# EAGLE design g3d2_master (EAGLE 5.12)
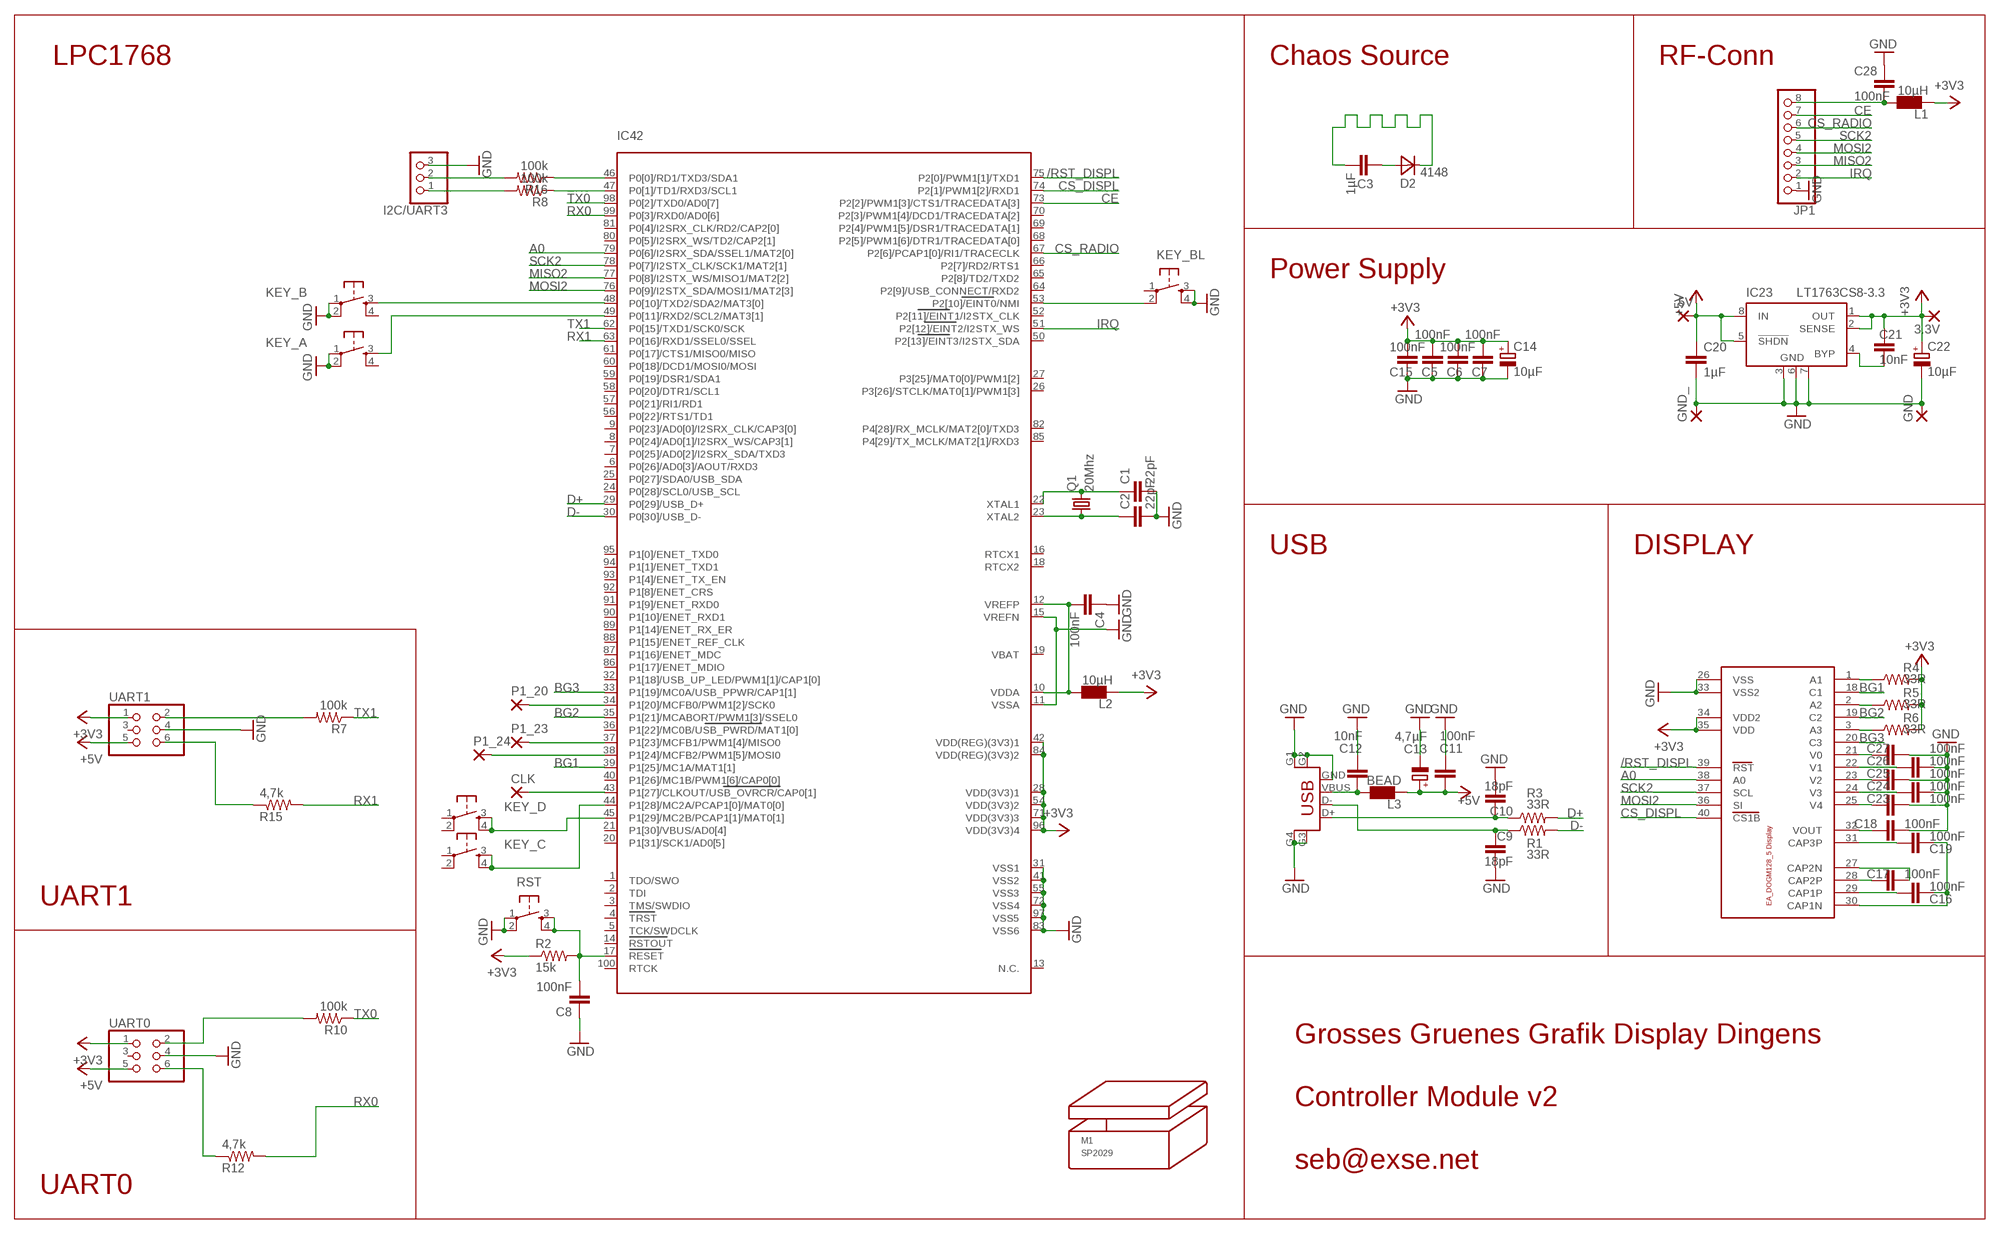
[diagram p0: schematic, sheet 1]

## Parts
3.3V  SMD2  [SMD1,27-2,54]
5V  SMD2  [SMD1,27-2,54]
C1  22pF  CAP0805  [0805]
C2  22pF  CAP0805  [0805]
C3  1µF  CAP0805  [0805]
C4  100nF  CAP0805  [0805]
C5  100nF  CAP0805  [0805]
C6  100nF  CAP0805  [0805]
C7  100nF  CAP0805  [0805]
C8  100nF  CAP0805  [0805]
C9  18pF  CAP0805  [0805]
C10  18pF  CAP0805  [0805]
C11  100nF  CAP0805  [0805]
C12  10nF  CAP0805  [0805]
C13  4,7µF  CPOL-EUSMCA  [SMC_A]
C14  10µF  CPOL-EUSMCA  [SMC_A]
C15  100nF  CAP0805  [0805]
C16  100nF  CAP0805  [0805]
C17  100nF  CAP0805  [0805]
C18  100nF  CAP0805  [0805]
C19  100nF  CAP0805  [0805]
C20  1µF  CAP0805  [0805]
C21  10nF  CAP0805  [0805]
C22  10µF  CPOL-EUSMCA  [SMC_A]
C23  100nF  CAP0805  [0805]
C24  100nF  CAP0805  [0805]
C25  100nF  CAP0805  [0805]
C26  100nF  CAP0805  [0805]
C27  100nF  CAP0805  [0805]
C28  100nF  CAP0805  [0805]
CLK  SMD2  [SMD1,27-2,54]
D2  4148  DIODE_0805  [DIODE_0805]
GND  SMD2  [SMD1,27-2,54]
GND_  SMD2  [SMD1,27-2,54]
I2C/UART3  PINHD-1X03_2.54-SMD-90°  [1X03SMD/90]
IC23  LT1763CS8-3.3  [SOIC8]
IC42  LPC1768  [LQFP100]
JP1  PINHD-1X08_2.54-SMD  [1X08SMD]
KEY_A  LSH  [LSH]
KEY_B  LSH  [LSH]
KEY_BL  LSH  [LSH]
KEY_C  LSH  [LSH]
KEY_D  LSH  [LSH]
L1  10µH  L0805  [0805]
L2  10µH  L0805  [0805]
L3  BEAD  [0805]
M1  SP2029  [SP2029]
P1_20  SMD2  [SMD1,27-2,54]
P1_23  SMD2  [SMD1,27-2,54]
P1_24  SMD2  [SMD1,27-2,54]
Q1  20Mhz  X22-OSCILLATOR  [X22]
R1  33R  RESISTOR0805-RES  [0805]
R2  15k  RESISTOR0805-RES  [0805]
R3  33R  RESISTOR0805-RES  [0805]
R4  33R  RESISTOR0805-RES  [0805]
R5  33R  RESISTOR0805-RES  [0805]
R6  33R  RESISTOR0805-RES  [0805]
R7  100k  RESISTOR0805-RES  [0805]
R8  100k  RESISTOR0805-RES  [0805]
R10  100k  RESISTOR0805-RES  [0805]
R12  4,7k  RESISTOR0805-RES  [0805]
R15  4,7k  RESISTOR0805-RES  [0805]
R16  100k  RESISTOR0805-RES  [0805]
RST  LSH  [LSH]
U$1  EA_DOG-M_DISPLAY  [E_DOG-M_DISPLAY]
UART0  PINHD-2X03_2.54-90°  [2X03/90]
UART1  PINHD-2X03_2.54-90°  [2X03/90]
X1  USB-SMD-NS  [USB-MINIB-NOSTOP]

## Nets
+3V3: 3.3V.1(P) C5.2 C6.2 C7.2 C14.+ C15.2 C21.1 C22.+ IC23.1(OUT) IC23.2(SENSE) IC42.28(VDD(3V3)1) IC42.42(VDD(REG)(3V3)1) IC42.54(VDD(3V3)2) IC42.71(VDD(3V3)3) IC42.84(VDD(REG)(3V3)2) IC42.96(VDD(3V3)4) L1.2 L2.2 R2.1 R4.2 R5.2 R6.2 U$1.34(VDD2) U$1.35(VDD) UART0.1 UART1.1
+5V: 5V.1(P) C11.1 C13.+ C20.1 IC23.5(!SHDN) IC23.8(IN) L3.2 UART0.5 UART1.5
/RST_DISPL: IC42.75(P2[0]/PWM1[1]/TXD1) U$1.39(RST)
A0: IC42.79(P0[6]/I2SRX_SDA/SSEL1/MAT2[0]) U$1.38(A0)
BG1: IC42.39(P1[25]/MC1A/MAT1[1]) U$1.18(C1)
BG2: IC42.35(P1[21]/MCABORT/PWM1[3]/SSEL0) U$1.19(C2)
BG3: IC42.33(P1[19]/MC0A/USB_PPWR/CAP1[1]) U$1.20(C3)
CE: IC42.73(P2[2]/PWM1[3]/CTS1/TRACEDATA[3]) JP1.7
CS_DISPL: IC42.74(P2[1]/PWM1[2]/RXD1) U$1.40(CS1B)
CS_RADIO: IC42.67(P2[6]/PCAP1[0]/RI1/TRACECLK) JP1.6
D+: IC42.29(P0[29]/USB_D+) R3.2
D-: IC42.30(P0[30]/USB_D-) R1.2
GND: C1.2 C2.2 C4.1 C5.1 C6.1 C7.1 C8.1 C9.1 C10.2 C11.2 C12.2 C13.- C14.- C15.1 C18.1 C20.2 C22.- C23.1 C24.1 C25.1 C26.1 C27.1 C28.1 GND.1(P) GND_.1(P) I2C/UART3.3 IC23.3(GND) IC23.6(GND) IC23.7(GND) IC42.11(VSSA) IC42.15(VREFN) IC42.31(VSS1) IC42.41(VSS2) IC42.55(VSS3) IC42.72(VSS4) IC42.83(VSS6) IC42.97(VSS5) JP1.1 KEY_A.1 KEY_A.2 KEY_B.1 KEY_B.2 KEY_BL.3 KEY_BL.4 RST.1 RST.2 U$1.26(VSS) U$1.33(VSS2) UART0.4 UART1.4 X1.G1(GND) X1.G2(GND) X1.G3(GND) X1.G4(GND) X1.GND
IRQ: IC42.51(P2[12]/EINT2/I2STX_WS) JP1.2
MISO2: IC42.77(P0[8]/I2STX_WS/MISO1/MAT2[2]) JP1.3
MOSI2: IC42.76(P0[9]/I2STX_SDA/MOSI1/MAT2[3]) JP1.4 U$1.36(SI)
N$1: C1.1 IC42.22(XTAL1) Q1.3
N$2: C2.1 IC42.23(XTAL2) Q1.1
N$3: C9.2 R1.1 X1.D-
N$4: IC42.53(P2[10]/EINT0/NMI) KEY_BL.2
N$5: C10.1 R3.1 X1.D+
N$6: C4.2 IC42.10(VDDA) IC42.12(VREFP) L2.1
N$7: C3.2 D2.1(C)
N$8: R10.2 UART0.2
N$9: C12.1 L3.1 X1.VBUS
N$10: IC42.47(P0[1]/TD1/RXD3/SCL1) R8.1
N$11: IC42.44(P1[28]/MC2A/PCAP1[0]/MAT0[0]) KEY_C.3 KEY_C.4
N$12: C8.2 IC42.17(RESET) R2.2 RST.3 RST.4
N$13: IC42.48(P0[10]/TXD2/SDA2/MAT3[0]) KEY_B.3
N$14: IC42.49(P0[11]/RXD2/SCL2/MAT3[1]) KEY_A.3
N$15: IC42.34(P1[20]/MCFB0/PWM1[2]/SCK0) P1_20.1(P)
N$16: IC42.37(P1[23]/MCFB1/PWM1[4]/MISO0) P1_23.1(P)
N$17: IC42.38(P1[24]/MCFB2/PWM1[5]/MOSI0) P1_24.1(P)
N$18: IC42.45(P1[29]/MC2B/PCAP1[1]/MAT0[1]) KEY_D.3 KEY_D.4
N$19: I2C/UART3.1 R8.2
N$20: IC42.46(P0[0]/RD1/TXD3/SDA1) R16.1
N$22: C3.1 D2.2(A)
N$23: CLK.1(P) IC42.43(P1[27]/CLKOUT/USB_OVRCR/CAP0[1])
N$24: C28.2 JP1.8 L1.1
N$25: C17.2 U$1.28(CAP2P)
N$26: C17.1 U$1.27(CAP2N)
N$27: C16.2 U$1.29(CAP1P)
N$28: C21.2 IC23.4(BYP)
N$29: C19.2 U$1.31(CAP3P)
N$30: C18.2 U$1.32(VOUT)
N$31: C16.1 C19.1 U$1.30(CAP1N)
N$32: C26.2 U$1.22(V1)
N$33: C27.2 U$1.21(V0)
N$34: C24.2 U$1.24(V3)
N$35: C23.2 U$1.25(V4)
N$36: C25.2 U$1.23(V2)
N$37: R6.1 U$1.3(A3)
N$38: R5.1 U$1.2(A2)
N$39: R4.1 U$1.1(A1)
N$40: I2C/UART3.2 R16.2
N$45: R12.1 UART0.6
N$49: R7.2 UART1.2
N$51: R15.1 UART1.6
RX0: IC42.99(P0[3]/RXD0/AD0[6]) R12.2
RX1: IC42.63(P0[16]/RXD1/SSEL0/SSEL) R15.2
SCK2: IC42.78(P0[7]/I2STX_CLK/SCK1/MAT2[1]) JP1.5 U$1.37(SCL)
TX0: IC42.98(P0[2]/TXD0/AD0[7]) R10.1
TX1: IC42.62(P0[15]/TXD1/SCK0/SCK) R7.1
Unconnected: IC42.1(TDO/SWO) IC42.2(TDI) IC42.3(TMS/SWDIO) IC42.4(TRST) IC42.5(TCK/SWDCLK) IC42.6(P0[26]/AD0[3]/AOUT/RXD3) IC42.7(P0[25]/AD0[2]/I2SRX_SDA/TXD3) IC42.8(P0[24]/AD0[1]/I2SRX_WS/CAP3[1]) IC42.9(P0[23]/AD0[0]/I2SRX_CLK/CAP3[0]) IC42.13(N.C.) IC42.14(RSTOUT) IC42.16(RTCX1) IC42.18(RTCX2) IC42.20(P1[31]/SCK1/AD0[5]) IC42.21(P1[30]/VBUS/AD0[4]) IC42.24(P0[28]/SCL0/USB_SCL) IC42.25(P0[27]/SDA0/USB_SDA) IC42.26(P3[26]/STCLK/MAT0[1]/PWM1[3]) IC42.27(P3[25]/MAT0[0]/PWM1[2]) IC42.32(P1[18]/USB_UP_LED/PWM1[1]/CAP1[0]) IC42.36(P1[22]/MC0B/USB_PWRD/MAT1[0]) IC42.40(P1[26]/MC1B/PWM1[6]/CAP0[0]) IC42.50(P2[13]/EINT3/I2STX_SDA) IC42.52(P2[11]/EINT1/I2STX_CLK) IC42.56(P0[22]/RTS1/TD1) IC42.57(P0[21]/RI1/RD1) IC42.58(P0[20]/DTR1/SCL1) IC42.59(P0[19]/DSR1/SDA1) IC42.60(P0[18]/DCD1/MOSI0/MOSI) IC42.61(P0[17]/CTS1/MISO0/MISO) IC42.64(P2[9]/USB_CONNECT/RXD2) IC42.65(P2[8]/TD2/TXD2) IC42.66(P2[7]/RD2/RTS1) IC42.68(P2[5]/PWM1[6]/DTR1/TRACEDATA[0]) IC42.69(P2[4]/PWM1[5]/DSR1/TRACEDATA[1]) IC42.70(P2[3]/PWM1[4]/DCD1/TRACEDATA[2]) IC42.80(P0[5]/I2SRX_WS/TD2/CAP2[1]) IC42.81(P0[4]/I2SRX_CLK/RD2/CAP2[0]) IC42.82(P4[28]/RX_MCLK/MAT2[0]/TXD3) IC42.85(P4[29]/TX_MCLK/MAT2[1]/RXD3) IC42.86(P1[17]/ENET_MDIO) IC42.87(P1[16]/ENET_MDC) IC42.88(P1[15]/ENET_REF_CLK) IC42.89(P1[14]/ENET_RX_ER) IC42.90(P1[10]/ENET_RXD1) IC42.91(P1[9]/ENET_RXD0) IC42.92(P1[8]/ENET_CRS) IC42.93(P1[4]/ENET_TX_EN) IC42.94(P1[1]/ENET_TXD1) IC42.95(P1[0]/ENET_TXD0) IC42.100(RTCK) KEY_A.4 KEY_B.4 KEY_BL.1 KEY_C.1 KEY_C.2 KEY_D.1 KEY_D.2 UART0.3 UART1.3

## Notes on the sheet
- LPC1768 | Chaos Source | RF-Conn
- Power Supply
- USB | DISPLAY
- UART1
- Grosses Gruenes Grafik Display Dingens
- Controller Module v2
- seb@exse.net
- UART0

## Power pins joined to a net without a drawn wire
VBAT: IC42.19(VBAT)

## Library data of the parts
3.3V 5V CLK GND GND_ P1_20 P1_23 P1_24 = wirepad:SMD2: SMD PAD
C1-C12 C15-C21 C23-C28 = SparkFun:CAP: Capacitor Standard 0603 ceramic capacitor, and 0.1" leaded capacitor.
C13 C14 C22 = rcl:CPOL-EU: POLARIZED CAPACITOR, European symbol
D2 = seb:DIODE_0805
I2C/UART3 = pinhead-2:PINHD-1X03: PIN HEADER
IC23 = linear-technology:LT1763CS8: 500mA, Low Noise, LDO Micropower Regulators Source: http://cds.linear.com/docs/Datasheet/1763ff.pdf
IC42 = microbuilder:LPC1768: LPC1768 100 MHz 32-bit ARM Cortex-M3 based microcontroller featuring a high level of integration and low power consumption. 512 kB Flash, 64 kB SRAM, USB Device/Host/OTG, Ethernet, CAN, I2S, 10-bit DAC Digikey: 568-4796-ND
JP1 = pinhead-2:PINHD-1X08: PIN HEADER
KEY_A KEY_B KEY_BL KEY_C KEY_D RST = switch-tact:LSH
L1 L2 = seb:L0805
L3 = seb:BEAD
M1 = strapubox:SP2029: Gehäuse Strapubox Typ 2029 max. Bauteilhöhe, top-layer: 11,5 mm max. Bauteilhöhe, bottom-layer: 3,5 mm (Dicke der LP: 1,5 mm) Außenmaße: Länge: 80 mm Breite: 61 mm Höhe: 20,5 mm
Q1 = seb:X22-OSCILLATOR
R1-R8 R10 R12 R15 R16 = SparkFun:RESISTOR: Resistor Basic schematic elements and footprints for 0603, 1206, and PTH resistors.
U$1 = display_ea_dogm128:EA_DOG-M_DISPLAY
UART0 UART1 = pinhead-2:PINHD-2X03: PIN HEADER
X1 = SparkFun:USB: USB Connectors USB-B-PTH is fully proven SKU : PRT-00139 USB-miniB is fully proven SKU : PRT-00587 USB-A-PCB is untested. USB-A-H is throughly reviewed, but untested. Spark Fun Electronics SKU : PRT-00437 USB-B-SMT is throughly reviewed, but untested. Needs silkscreen touching up. USB-A-S has not been used/tested USB-MB-H has not been used/tested

## Net classes
1 FAT: width 0.2 mm, drill 0.4 mm
2 GND/3V3: width 0.2 mm, drill 0.4 mm

## Board
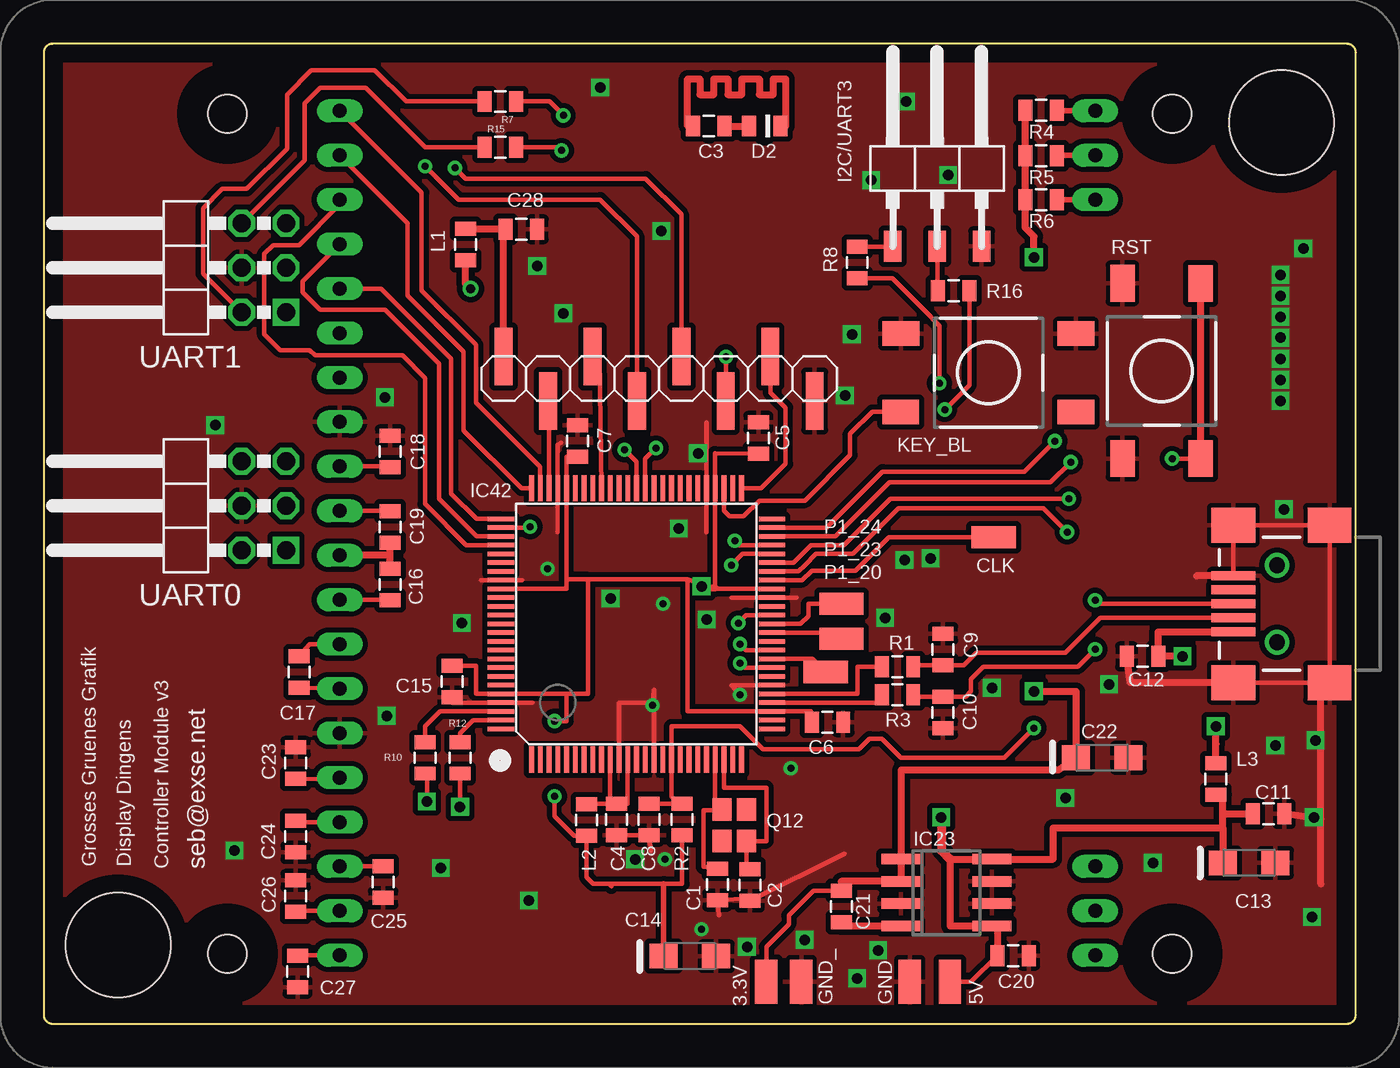
[diagram p1: board, top side]
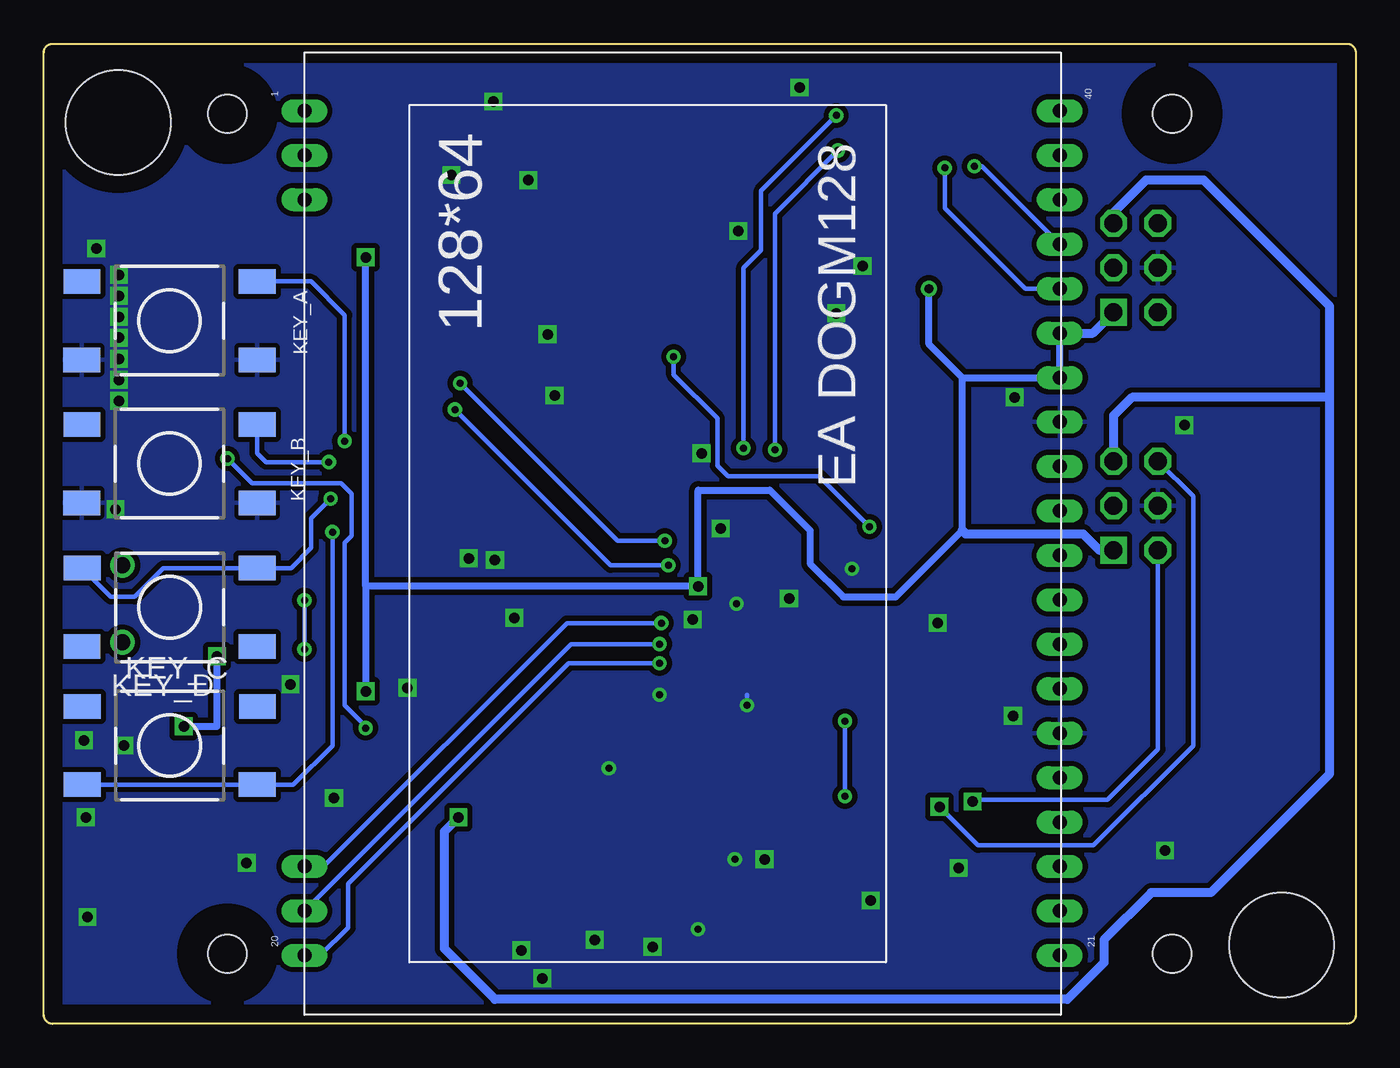
[diagram p2: board, bottom side, seen from below]

Size 75 x 56 mm. Coordinates in mm from the lower left corner, seen from the top.
Copper layers (1*16): Top 0.035mm / dielectric 1.5mm / Bottom 0.035mm
Design rules "default *": minimum track width 10mil, minimum drill 0.4mm, track to track 8mil, track to pad 8mil, pad to pad 8mil, via to via 8mil, smd to smd 8mil, copper to edge 40mil, drill to drill 8mil, minimum pad ring 10mil, minimum via ring 8mil, stop-mask expansion 4mil, vias tented up to drill 40mil, thermal gap 10mil
tRestrict: 2 lines

### Footprints (pad centres in the part's own frame; a part is rotated, then mirrored left to right if it is on the bottom)
SMD1,27-2,54 = smd 1.27 x 2.54: 1 0,0
0805 = smd 0.8 x 1.2: 1 -0.9,0; 2 0.9,0
SMC_A = smd 1.6 x 1.4: + -1.5,0; - 1.5,0
DIODE_0805 = smd 0.8 x 1.2: 1 -0.9,0; 2 0.9,0
1X03SMD/90 = smd 1.016 x 1.778: 1 -1.27,-5.08; 2 1.27,-5.08; 3 3.81,-5.08
SOIC8 = smd 0.6 x 2.2: 1 -1.905,-2.6; 2 -0.635,-2.6; 3 0.635,-2.6; 4 1.905,-2.6; 5 1.905,2.6; 6 0.635,2.6; 7 -0.635,2.6; 8 -1.905,2.6
LQFP100 = smd 0.27 x 1.5: 1 -6,-7.75; 2 -5.5,-7.75; 3 -5,-7.75; 4 -4.5,-7.75; 5 -4,-7.75; 6 -3.5,-7.75; 7 -3,-7.75; 8 -2.5,-7.75; 9 -2,-7.75; 10 -1.5,-7.75; 11 -1,-7.75; 12 -0.5,-7.75; 13 0,-7.75; 14 0.5,-7.75; 15 1,-7.75; 16 1.5,-7.75; 17 2,-7.75; 18 2.5,-7.75; 19 3,-7.75; 20 3.5,-7.75; 21 4,-7.75; 22 4.5,-7.75; 23 5,-7.75; 24 5.5,-7.75; 25 6,-7.75; 51 6,7.75; 52 5.5,7.75; 53 5,7.75; 54 4.5,7.75; 55 4,7.75; 56 3.5,7.75; 57 3,7.75; 58 2.5,7.75; 59 2,7.75; 60 1.5,7.75; 61 1,7.75; 62 0.5,7.75; 63 0,7.75; 64 -0.5,7.75; 65 -1,7.75; 66 -1.5,7.75; 67 -2,7.75; 68 -2.5,7.75; 69 -3,7.75; 70 -3.5,7.75; 71 -4,7.75; 72 -4.5,7.75; 73 -5,7.75; 74 -5.5,7.75; 75 -6,7.75 | smd 1.5 x 0.27: 26 7.75,-6; 27 7.75,-5.5; 28 7.75,-5; 29 7.75,-4.5; 30 7.75,-4; 31 7.75,-3.5; 32 7.75,-3; 33 7.75,-2.5; 34 7.75,-2; 35 7.75,-1.5; 36 7.75,-1; 37 7.75,-0.5; 38 7.75,0; 39 7.75,0.5; 40 7.75,1; 41 7.75,1.5; 42 7.75,2; 43 7.75,2.5; 44 7.75,3; 45 7.75,3.5; 46 7.75,4; 47 7.75,4.5; 48 7.75,5; 49 7.75,5.5; 50 7.75,6; 76 -7.75,6; 77 -7.75,5.5; 78 -7.75,5; 79 -7.75,4.5; 80 -7.75,4; 81 -7.75,3.5; 82 -7.75,3; 83 -7.75,2.5; 84 -7.75,2; 85 -7.75,1.5; 86 -7.75,1; 87 -7.75,0.5; 88 -7.75,0; 89 -7.75,-0.5; 90 -7.75,-1; 91 -7.75,-1.5; 92 -7.75,-2; 93 -7.75,-2.5; 94 -7.75,-3; 95 -7.75,-3.5; 96 -7.75,-4; 97 -7.75,-4.5; 98 -7.75,-5; 99 -7.75,-5.5; 100 -7.75,-6
1X08SMD = smd 1.016 x 3.302: 1 -1.27,1.27; 2 1.27,-1.27; 3 3.81,1.27; 4 6.35,-1.27; 5 8.89,1.27; 6 11.43,-1.27; 7 13.97,1.27; 8 16.51,-1.27
LSH = smd 2.1 x 1.4: 1 -5.005,2.24; 2 5.015,2.24; 3 -5.005,-2.24; 4 5.005,-2.24
SP2029 = hole 2.2: -27,-24; -27,24; 27,24; 27,-24 | hole 6: 33.25,23.5; -33.25,-23.5
X22 = smd 1.3 x 1.1: 1 0.9,0.7; 2 -0.9,0.7; 3 -0.9,-0.7; 4 0.9,-0.7
E_DOG-M_DISPLAY = drill 0.8 long: 1 0.032,0; 2 2.572,0; 3 5.112,0; 18 43.212,0; 19 45.752,0; 20 48.292,0; 21 48.292,43.18; 22 45.752,43.18; 23 43.212,43.18; 24 40.672,43.18; 25 38.132,43.18; 26 35.592,43.18; 27 33.052,43.18; 28 30.512,43.18; 29 27.972,43.18; 30 25.432,43.18; 31 22.892,43.18; 32 20.352,43.18; 33 17.812,43.18; 34 15.272,43.18; 35 12.732,43.18; 36 10.192,43.18; 37 7.652,43.18; 38 5.112,43.18; 39 2.572,43.18; 40 0.032,43.18
2X03/90 = drill 1.016 square: 1 -2.54,-6.35 | drill 1.016 octagon: 2 -2.54,-3.81; 3 0,-6.35; 4 0,-3.81; 5 2.54,-6.35; 6 2.54,-3.81
USB-MINIB-NOSTOP = smd 2.5 x 0.5: D+ 2.5,0; D- 2.5,0.8; GND 2.5,-1.6; ID 2.5,-0.8; VBUS 2.5,1.6 | smd 2.5 x 2: G1 -3,-4.5; G2 -3,4.5; G3 2.5,4.5; G4 2.5,-4.5 | drill 0.9 pad 0.8 round: H1 0,2.2 | drill 0.9 pad 0.787 round: H2 0,-2.2

### Placement (x,y rotation side)
3.3V  41.3,2.4 0 top
5V  51.8,2.4 0 top
C1  38.51,7.96 270 top
C2  40.36,7.92 270 top
C3  38,51.3 180 top
C4  32.75,11.68 90 top
C5  40.85,33.46 270 top
C6  44.8,17.24 180 top
C7  30.51,33.3 270 top
C8  34.6,11.68 90 top
C9  51.4,21.4 270 top
C10  51.4,17.8 270 top
C11  70,12 0 top
C12  62.8,21 180 top
C13  68.9,9.2 0 top
C14  36.94,3.87 0 top
C15  23.35,19.57 90 top
C16  19.8,25.1 270 top
C17  14.6,20.1 90 top
C18  19.8,32.7 270 top
C19  19.8,28.4 90 top
C20  55.4,3.9 0 top
C21  45.6,6.7 270 top
C22  60.5,15.2 0 top
C23  14.4,14.9 270 top
C24  14.4,10.7 90 top
C25  19.4,8.1 90 top
C26  14.4,7.3 270 top
C27  14.5,3 90 top
C28  27.31,45.4 180 top
CLK  54.3,27.8 90 top
D2  41.2,51.3 180 top
GND  49.5,2.4 0 top
GND_  43.3,2.4 0 top
I2C/UART3  49.8,49.5 0 top
IC23  51.6,7.5 270 top
IC42  33.88,22.85 0 top
JP1  42.8,36.86 180 top
KEY_A  67.81,40.18 180 bottom
KEY_B  67.81,32.01 180 bottom
KEY_BL  54,37.2 180 top
KEY_C  67.8,15.9 0 bottom
KEY_D  67.8,23.8 180 bottom
L1  24.1,44.52 270 top
L2  31.03,11.65 270 top
L3  67,14 270 top
M1  37.5,28 0 top
P1_20  44.7,20.1 270 top
P1_23  45.6,22 270 top
P1_24  45.6,24 270 top
Q1  39.47,11.34 270 top
R1  48.8,20.4 180 top
R2  36.49,11.68 90 top
R3  48.8,18.8 180 top
R4  57,52.2 180 top
R5  57,49.6 180 top
R6  57,47.1 180 top
R7  26.1,52.7 180 top
R8  46.5,43.5 90 top
R10  21.8,15.2 270 top
R12  23.8,15.2 90 top
R15  26.1,50.1 0 top
R16  52,41.9 180 top
RST  63.9,37.3 90 top
U$1  60.1,52.2 270 bottom
UART0  7.5,29.6 90 top
UART1  7.5,43.2 90 top
X1  70.5,24 180 top

### Tracks (layer width: path | path; a pad name or v marks a point on that pad's centre or on a via)
+3V3  (via drill 0.4, 0.5, 0.6)
  Top 0.254: 29.88,25.4 29.88,24.85 IC42.84 | 29.88,25.4 IC42.71 29.88,32.41 C7.2 | 29.88,18.85 IC42.96 24.7,18.85 24.7,20.47 C15.2 | 29.88,18.85 29.88,17.3 v29.2,17.3 | 38.38,24.9 IC42.54 38.37,32.59 C5.2 | 31.1,25.4 36.8,25.4 | 36.8,25.4 38.38,24.9 | 31.1,25.4 29.88,25.4 | IC42.42 38.38,24.85 38.38,24.9 | C6.2 43.86,17.85 IC42.28 36.8,17.85 36.8,25.4 | R2.1 36.49,8 35.43,8 32.3,8 | 32.3,8 31.4,8 31.03,8.37 L2.2 30.3,10.75 29.2,11.85 v29.2,13 | 29.88,18.85 31.1,18.85 31.1,25.4 | 3.3V.1 41.3,4.4 42.6,5.7 42.6,6.2 44,7.6 C21.1 | 32.3,8 32.45,7.85
  Top 0.305: C14.+ 35.43,6.13 35.43,8
  Top 0.406: v37.6,25 37.6,24.9 38.38,24.9 | R4.2 R5.2 R6.2 56.1,45.5 56.6,45 v56.6,43.8 | C21.1 45.6,8.14 IC23.2 IC23.1 49,14.5 58,14.5 C22.+ 59,19 v56.6,19 | L1.2 24.1,42.3 v24.4,42
  Bottom 0.254: v29.2,13 v29.2,17.3
  Bottom 0.406: 56.6,25 v56.6,19 | 56.6,25 v37.6,25 37.6,30.5 33.5,30.5 31.2,28.2 31.2,26.3 29.3,24.4 26.3,24.4 22.5,28.2 22.5,36.93 | 22.5,36.93 U$1.34 U$1.35 | 56.6,25 v56.6,43.8 | v24.4,42 24.4,38.83 22.5,36.93
  Bottom 0.5: U$1.35 15.04,39.47 UART1.1 | UART0.1 14.66,27.06 15.6,28 22.3,28 22.5,28.2
+5V  (via drill 0.6)
  Top 0.254: 5V.1 53,2.4 C20.1
  Top 0.406: L3.2 67.4,13.1 67.4,12 | 67.4,11.2 C13.+ | 67.4,11.2 67.4,12 | 67.4,12 C11.1 | 67.4,11.2 57.7,11.2 57.7,9.41 IC23.8 51.8,9.41 51.8,5.59 IC23.5 54.5,5.59 C20.1
  Top 0.5: v51.3,11.8 51.3,9.91 51.8,9.41
  Bottom 0.5: UART1.5 13.85,46.35 12,48.2 8.7,48.2 1.5,41 1.5,35.9 | 1.5,35.9 1.5,14.3 8.3,7.5 11.7,7.5 14.4,4.8 14.4,3.5 16.5,1.4 49.2,1.4 52.1,4.3 52.1,11 v51.3,11.8 | UART0.5 13.85,34.75 12.8,35.8 1.6,35.8 1.5,35.9
/RST_DISPL
  Top 0.254: IC42.75 27.3,30.6 24,33.9 24,38.4 20.8,41.6 20.8,45.75 U$1.39
A0
  Top 0.254: IC42.79 24.15,27.35 21.8,29.7 21.8,36.9 20.5,38.2 15.5,38.2 15.2,38.5 13.5,38.5 12.6,39.4 12.6,44 13.1,44.5 14.6,44.5 16.92,46.82 U$1.38
BG1  (via drill 0.4)
  Top 0.254: IC42.39 40.15,23.35 v39.7,22.9
  Bottom 0.254: U$1.18 59,8.99 45.09,22.9 v39.7,22.9
BG2  (via drill 0.4)
  Top 0.254: IC42.35 40.15,21.35 v39.8,21.7
  Bottom 0.254: v39.8,21.7 44.85,21.7 U$1.19
BG3  (via drill 0.4)
  Top 0.254: IC42.33 40.05,20.35 v39.8,20.6
  Bottom 0.254: U$1.20 59.19,3.91 57.6,5.5 57.6,8.01 45.01,20.6 v39.8,20.6
CE
  Top 0.254: JP1.7 28.88,35.34 IC42.73
CS_DISPL
  Top 0.254: IC42.74 28.38,31.82 24.7,35.5 24.7,38.8 21.6,41.9 21.6,47.49 U$1.40
CS_RADIO
  Top 0.254: IC42.67 31.78,38.12 JP1.6
D+
  Top 0.254: IC42.29 47.9,18.35 R3.2
D-
  Top 0.254: IC42.30 46.5,18.85 46.5,20.4 R1.2
GND  (via drill 0.4, 0.6)
  Top 0.254: 39.3,24.35 IC42.41 43.03,24.35 | IC42.31 39.3,19.35 v39.8,18.8 | 29.38,28.1 IC42.72 29.38,33.08 29.56,33.2 | IC42.11 32.88,18.35 34.88,18.35 | 34.88,18.35 IC42.15 | 34.88,18.35 34.88,19.1 v34.8,18.2 | 37.88,34.38 IC42.55 37.88,28.1 | C8.1 34.7,10.78 | C4.1 C8.1 | C8.1 34.7,9.9 | 38.61,6.2 C1.2 40.36,7.16 C2.2 45.78,9.72 | X1.GND X1.G4 X1.G1 X1.G2 73,19.5 X1.G3 71.9,19.5 | C15.1 23.35,18.35 IC42.97 27.93,18.35 | 27.33,25.35 IC42.83 25,25.35
  Top 0.406: 69.1,19.5 X1.G3 62.1,19.5 C12.2 | 73,11.7 73,19.5 | 73,8 73,11.7 | 73,11.7 C11.2 | X1.GND 65.9,25.6
  Bottom 0.254: v34.8,18.2 34.8,18.8
  other vias: 35.4,24 28.8,26 35.5,9.4 37.6,5.4 42.7,14.6 9.8,34.2 19.5,35.8 23.9,22.9 32.4,24.3 36.3,28.3 48.1,23.2 50.7,26.6 27.72,7.05 22.7,8.9 31.8,53.5 40.2,4.4 54.2,19.2 49.2,26.5 58.4,12.9 72.5,6.1 72.6,11.8 72.7,16.2 70.9,29.4 60.9,19.4 70.7,42.8 33.8,9.4 45.8,35.9 72,44.3 70.7,35.6 70.7,36.8 70.7,38 70.7,39.2 70.7,40.4 70.7,41.6 28.2,43.3 46.2,39.4 47.3,48.2 49.3,52.7 51.7,48.5 70.4,15.9 63.4,9.2 46.5,2.6 47.7,4.2 43.5,4.8 37.4,32.6 35.3,45.3 29.7,40.6 37.9,23.1 10.9,9.9 19.6,17.6
  pour Bottom (isolate 0.305): 0,0.2 74.8,0 74.9,55.9 0.1,56.1
  pour Top (isolate 0.305): 0,0 74.9,0 75,56.1 0.1,56.1
IRQ
  Top 0.254: 41.7,38.2 JP1.2 41.53,36.07 42.4,35.2 42.4,32 41,30.6 IC42.51
MISO2  (via drill 0.4)
  Top 0.254: IC42.77 27.75,28.35 v27.8,28.4 | v38.99,38.11 JP1.3
  Bottom 0.254: v27.8,28.4 30.7,31.3 35.9,31.3 36.5,31.9 36.5,34.6 38.99,37.09 v38.99,38.11
MOSI2  (via drill 0.4)
  Top 0.254: U$1.36 19.29,42.01 23.3,38 23.3,30.3 24.75,28.85 IC42.76 | JP1.4 36.45,46.25 34.4,48.3 24.1,48.3 v23.5,48.9
  Bottom 0.254: v23.5,48.9 23.5,46.61 18.9,42.01 U$1.36
N$1
  Top 0.254: IC42.22 38.38,12.24 Q1.3 38.77,12.2 37.7,12.2 37.7,8.96 C1.1
N$2
  Top 0.254: C2.1 40.17,8.92 Q1.1 41.3,10.44 41.3,13.5 38.88,13.5 IC42.23
N$3
  Top 0.254: R1.1 49.8,20.5 C9.2 52.6,20.5 53.3,21.2 58.4,21.2 60.4,23.2 X1.D- 68.6,23.2 68.6,23.1
N$4
  Top 0.254: IC42.53 38.88,29.32 39.2,29 40,29 40.9,29.9 43.5,29.9 46.1,32.5 46.1,33.7 47.36,34.96 KEY_BL.2
N$5  (via drill 0.4)
  Top 0.254: 49.7,18.7 R3.1 49.8,18.7 C10.1 52.7,18.7 53,19 53,19.7 53.7,20.4 59.1,20.4 v60.1,21.4 | v60.1,24.2 60.1,24 X1.D+
  Bottom 0.254: v60.1,21.4 v60.1,24.2
N$6
  Top 0.254: IC42.12 33.38,12.58 C4.2 | IC42.10 32.38,12.58 C4.2 | L2.1 31.03,12.58 C4.2
N$7
  Top 0.406: C3.2 36.8,51.3 36.8,54 37.5,54 37.5,53.1 38.3,53.1 38.3,54 39.1,54 39.1,53.1 39.9,53.1 39.9,54 40.9,54 40.9,53.1 41.7,53.1 41.7,54 42.4,54 42.4,51.3 D2.1
N$8  (via drill 0.6)
  Top 0.254: R10.2 21.9,14.3 v21.9,12.7
  Bottom 0.254: v21.9,12.7 21.8,12.8 14.2,12.8 11.31,15.69 UART0.2
N$9  (via drill 0.6)
  Top 0.406: X1.VBUS 63.7,22.4 C12.1 v65.1,21 | v67,17 67,16 L3.1
  Bottom 0.406: v65.1,21 65.1,17 v67,17
N$10  (via drill 0.4)
  Top 0.254: IC42.47 39.75,27.35 v39.5,27.6 | v51.2,36.6 51.2,39.9 50.3,40.8 48.5,42.6 R8.1
  Bottom 0.254: v39.5,27.6 42.2,27.6 v51.2,36.6
N$11  (via drill 0.4)
  Top 0.254: v58.5,28.1 57.15,29.45 48.85,29.45 46.25,26.85 44.15,26.85 43.5,26.2 43.15,25.85 IC42.44
  Bottom 0.254: v58.5,28.1 58.5,15.9 60.74,13.66 KEY_C.4 KEY_C.3
N$12  (via drill 0.4)
  Top 0.254: C8.2 R2.2 35.88,12.98 IC42.17 35.88,17 39.8,17 41.1,15.7 46.6,15.7 47.2,16.3 47.9,16.3 49,15.2 54.9,15.2 v56.6,16.9 | v64.5,32.3 RST.3
  Top 0.406: RST.3 RST.4
  Bottom 0.254: v56.6,16.9 56.6,17 57.8,18.2 57.8,27.5 57.4,27.9 57.4,30.3 58,30.9 63.1,30.9 v64.5,32.3
N$13  (via drill 0.4)
  Top 0.254: v58.7,32.1 57.55,30.95 48.35,30.95 45.25,27.85 IC42.48
  Bottom 0.254: v58.7,32.1 62.3,32.1 62.81,32.6 KEY_B.3
N$14  (via drill 0.4)
  Top 0.254: v57.8,33.3 56.05,31.55 47.95,31.55 44.75,28.35 IC42.49
  Bottom 0.254: v57.8,33.3 57.8,40.5 59.72,42.42 KEY_A.3
N$15
  Top 0.254: IC42.34 43.95,20.85 P1_20.1
N$16
  Top 0.254: IC42.37 45.25,22.35 P1_23.1
N$17
  Top 0.254: IC42.38 43.25,22.85 43.7,23.3 43.7,24 P1_24.1
N$18  (via drill 0.4)
  Top 0.254: 58.55,29.95 v58.6,30 48.4,30 45.75,27.35 43.85,27.35 43.4,26.9 42.85,26.35 IC42.45
  Bottom 0.254: v58.6,30 59.7,28.9 59.7,27.2 60.86,26.04 KEY_D.3 68.16,26.04 69.8,24.4 71.17,24.4 KEY_D.4
N$19
  Top 0.254: R8.2 48.51,44.4 I2C/UART3.1
N$20  (via drill 0.4)
  Top 0.254: IC42.46 39.95,26.85 v39.3,26.2 | v51.5,35.1 52.9,36.5 R16.1
  Bottom 0.254: v39.3,26.2 42.6,26.2 v51.5,35.1
N$22
  Top 0.406: C3.1 D2.2
N$23
  Top 0.254: CLK.1 48.3,27.8 46.4,25.9 43.9,25.9 43.35,25.35 IC42.43
N$24
  Top 0.406: JP1.8 26.29,45.22 C28.2 24.12,45.4 L1.1
N$25
  Top 0.254: C17.2 15.21,21.69 U$1.28
N$26
  Top 0.254: C17.1 16.85,19.15 U$1.27
N$27
  Top 0.254: C16.2 19.77,24.23 U$1.29
N$28
  Top 0.406: C21.2 45.6,5.59 IC23.4
N$29
  Top 0.254: C19.2 U$1.31
N$30
  Top 0.254: C18.2 19.75,31.85 U$1.32
N$31
  Top 0.406: 19.8,26.77 C19.1 | 19.8,26.77 U$1.30 | C16.1 19.8,26.77
N$32
  Top 0.254: C26.2 14.45,6.45 U$1.22
N$33
  Top 0.254: C27.2 U$1.21
N$34
  Top 0.254: C24.2 14.47,11.53 U$1.24
N$35
  Top 0.254: C23.2 16.57,13.97 U$1.25
N$36
  Top 0.254: C25.2 19.39,8.99 U$1.23
N$37
  Top 0.305: R6.1 57.81,47.09 U$1.3
N$38
  Top 0.305: R5.1 57.93,49.63 U$1.2
N$39
  Top 0.305: R4.1 57.93,52.17 U$1.1
N$40
  Top 0.254: R16.2 51.1,44.39 I2C/UART3.2
N$45  (via drill 0.6)
  Top 0.254: v23.8,12.4 R12.1
  Bottom 0.254: v23.8,12.4 21.6,10.2 15,10.2 9.3,15.9 9.3,30.13 UART0.6
N$49
  Top 0.254: R7.2 20.7,52.7 18.9,54.5 15.3,54.5 13.9,53.1 13.9,50 11.6,47.7 10.2,47.7 9.1,46.6 9.1,42.87 UART1.2
N$51
  Top 0.254: R15.1 21.8,50.1 18.4,53.5 15.8,53.5 14.9,52.6 14.9,49.33 UART1.6
RX0
  Top 0.254: IC42.99 24.55,17.35 23.8,16.6 R12.2
RX1  (via drill 0.4)
  Top 0.254: IC42.63 33.88,32.12 v33.2,32.8 | R15.2 29.4,50.1 v29.6,49.9
  Bottom 0.254: v33.2,32.8 33.2,46.3 v29.6,49.9
SCK2  (via drill 0.4)
  Top 0.254: U$1.37 14.8,42.43 14.8,41.8 15.8,40.8 19.5,40.8 22.6,37.7 22.6,30 24.75,27.85 IC42.78 | JP1.5 33.91,44.99 31.8,47.1 23.7,47.1 v21.8,49
  Bottom 0.254: v21.8,49 21.37,49 U$1.37
TX0
  Top 0.254: IC42.98 22.65,17.85 21.8,17 R10.1
TX1  (via drill 0.4)
  Top 0.254: IC42.62 34.38,32.28 v35,32.9 | R7.1 28.9,52.7 v29.7,51.9
  Bottom 0.254: v35,32.9 35,43.2 34,44.2 34,47.6 v29.7,51.9

### Text on the board
tNames: Q12 | Grosses Gruenes Grafik | Display Dingens | Controller Module v3 | seb@exse.net